# Altium schematic sheet Power.SchDoc
size A4; SheetNumber: 3; SheetTotal: 5
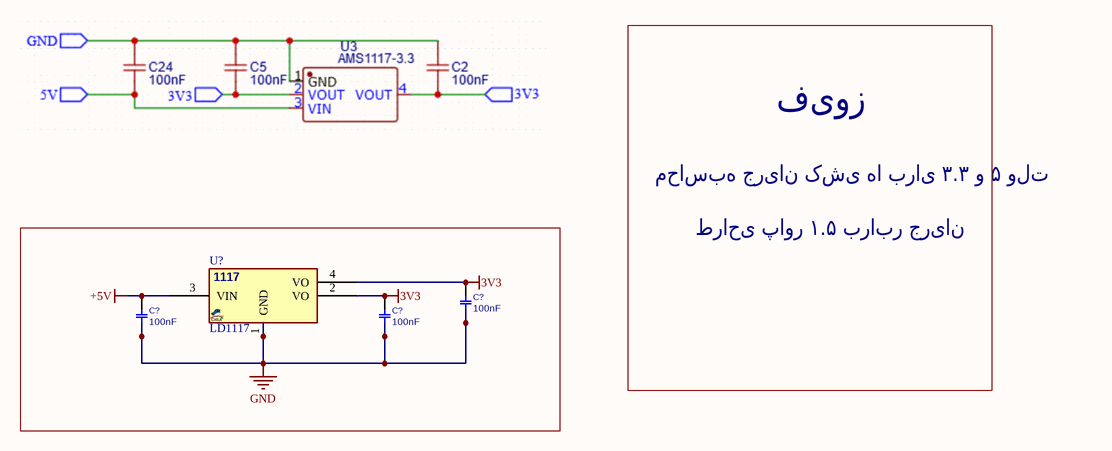
[diagram p0: Power.SchDoc]

## Parts
(Parts that share a designator on the sheet are numbered #1, #2 ... from top to bottom, then left to right.)
C?#1  100nF  [C0402]
C?#2  100nF  [C0402]
C?#3  100nF  [C0402]
U?  LD1117  [SOT223_4]

## Nets
3V3: C?#1.1 C?#3.1 U?.2(VO) U?.4(VO)
+5V: C?#2.1 U?.3(VIN)
GND: C?#1.2 C?#2.2 C?#3.2 U?.1(GND)

## Notes on the sheet
- فیوز
- محاسبه جریان کشی ها برای ۳.۳ و ۵ ولت
- طراحی پاور ۱.۵ برابر جریان
- (in symbol VREG_1117_SOT223) 1117

## Library data of the parts
C?#1-C?#3 = CAP_SMD_MLCC: CAP, MLCC; PARAM: C0G, 10%; DESC: CAP, MLCC, 1nF, 50V, C0G, 10%, 0402; MANF_P#: MANF_PART#; MANF: Murata; PARAM2: 50V; PRICE: 100= 1$; ASSEMBLY: ASSEMBLY; VALUE: 100nF
U? = VREG_1117_SOT223: REG, Linear, LDO1V, 0.8A, SOT-223; MANF_P#: LD1117, LM1117, AMS1117, TLV1117, REG1117, NCP1117, LT1117, SPX1117; MANF: TI, ON, ST; PARAM2: 1.2/1.5/1.8/2.5/2.85/3.3/5V; PARAM: LDO1V, 0.8A; VALUE: LD1117